# EAGLE design h-bridge (EAGLE 7.6.0)
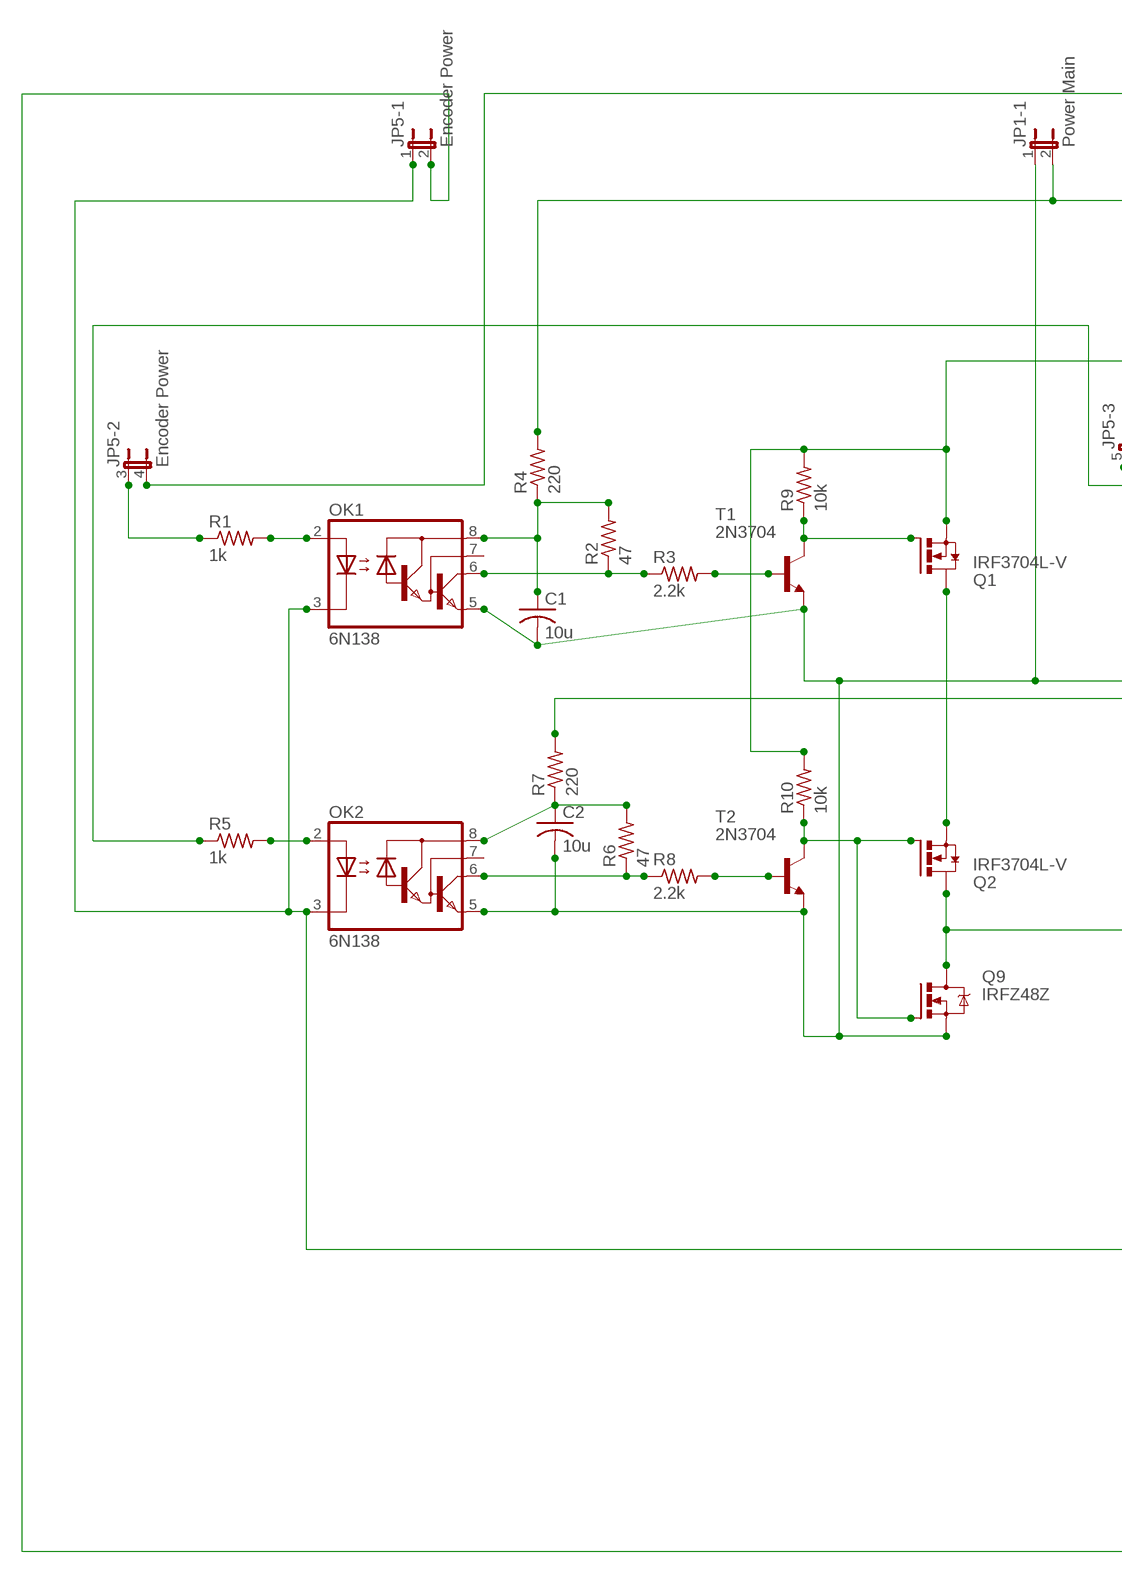
[diagram p0: schematic, sheet 1, part 1 of 2]
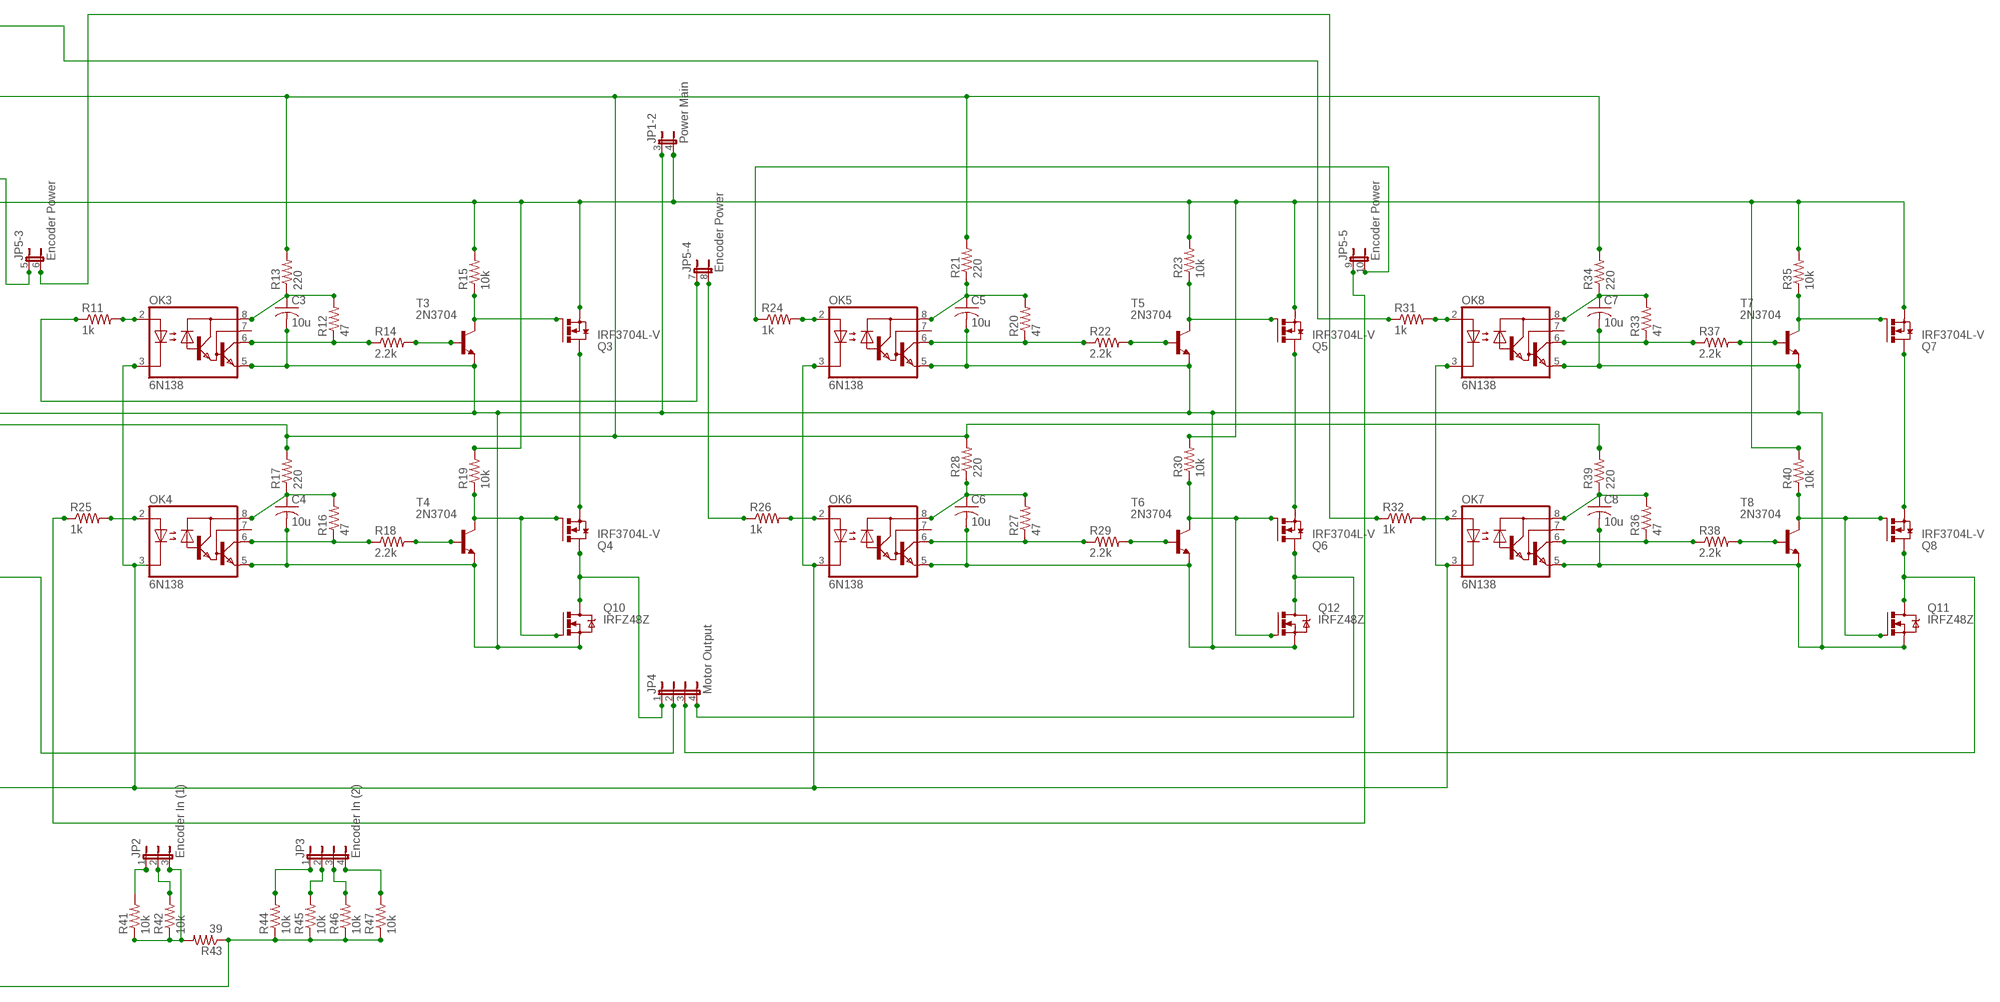
[diagram p1: schematic, sheet 1, part 2 of 2]

## Parts
C1  10u  C-US025-025X050  [C025-025X050]
C2  10u  C-US025-025X050  [C025-025X050]
C3  10u  C-US025-025X050  [C025-025X050]
C4  10u  C-US025-025X050  [C025-025X050]
C5  10u  C-US025-025X050  [C025-025X050]
C6  10u  C-US025-025X050  [C025-025X050]
C7  10u  C-US025-025X050  [C025-025X050]
C8  10u  C-US025-025X050  [C025-025X050]
JP1  Power Main  JP2QE  [JP2Q]
JP2  Encoder In (1)  JP2E  [JP2]
JP3  Encoder In (2)  JP4E  [JP4]
JP4  Motor Output  JP4E  [JP4]
JP5  Encoder Power  JP5QE  [JP5Q]
OK1  6N138  [DIL08]
OK2  6N138  [DIL08]
OK3  6N138  [DIL08]
OK4  6N138  [DIL08]
OK5  6N138  [DIL08]
OK6  6N138  [DIL08]
OK7  6N138  [DIL08]
OK8  6N138  [DIL08]
Q1  IRF3704L-V  [TO262-V]
Q2  IRF3704L-V  [TO262-V]
Q3  IRF3704L-V  [TO262-V]
Q4  IRF3704L-V  [TO262-V]
Q5  IRF3704L-V  [TO262-V]
Q6  IRF3704L-V  [TO262-V]
Q7  IRF3704L-V  [TO262-V]
Q8  IRF3704L-V  [TO262-V]
Q9  IRFZ48Z  [TO220BH]
Q10  IRFZ48Z  [TO220BH]
Q11  IRFZ48Z  [TO220BH]
Q12  IRFZ48Z  [TO220BH]
R1  1k  R-US_0207/10  [0207/10]
R2  47  R-US_0207/10  [0207/10]
R3  2.2k  R-US_0207/10  [0207/10]
R4  220  R-US_0207/10  [0207/10]
R5  1k  R-US_0207/10  [0207/10]
R6  47  R-US_0207/10  [0207/10]
R7  220  R-US_0207/10  [0207/10]
R8  2.2k  R-US_0207/10  [0207/10]
R9  10k  R-US_0207/10  [0207/10]
R10  10k  R-US_0207/10  [0207/10]
R11  1k  R-US_0207/10  [0207/10]
R12  47  R-US_0207/10  [0207/10]
R13  220  R-US_0207/10  [0207/10]
R14  2.2k  R-US_0207/10  [0207/10]
R15  10k  R-US_0207/10  [0207/10]
R16  47  R-US_0207/10  [0207/10]
R17  220  R-US_0207/10  [0207/10]
R18  2.2k  R-US_0207/10  [0207/10]
R19  10k  R-US_0207/10  [0207/10]
R20  47  R-US_0207/10  [0207/10]
R21  220  R-US_0207/10  [0207/10]
R22  2.2k  R-US_0207/10  [0207/10]
R23  10k  R-US_0207/10  [0207/10]
R24  1k  R-US_0207/10  [0207/10]
R25  1k  R-US_0207/10  [0207/10]
R26  1k  R-US_0207/10  [0207/10]
R27  47  R-US_0207/10  [0207/10]
R28  220  R-US_0207/10  [0207/10]
R29  2.2k  R-US_0207/10  [0207/10]
R30  10k  R-US_0207/10  [0207/10]
R31  1k  R-US_0207/10  [0207/10]
R32  1k  R-US_0207/10  [0207/10]
R33  47  R-US_0207/10  [0207/10]
R34  220  R-US_0207/10  [0207/10]
R35  10k  R-US_0207/10  [0207/10]
R36  47  R-US_0207/10  [0207/10]
R37  2.2k  R-US_0207/10  [0207/10]
R38  2.2k  R-US_0207/10  [0207/10]
R39  220  R-US_0207/10  [0207/10]
R40  10k  R-US_0207/10  [0207/10]
R41  10k  R-US_0207/10  [0207/10]
R42  10k  R-US_0207/10  [0207/10]
R43  39  R-US_0207/10  [0207/10]
R44  10k  R-US_0207/10  [0207/10]
R45  10k  R-US_0207/10  [0207/10]
R46  10k  R-US_0207/10  [0207/10]
R47  10k  R-US_0207/10  [0207/10]
T1  2N3704  [TO92]
T2  2N3704  [TO92]
T3  2N3704  [TO92]
T4  2N3704  [TO92]
T5  2N3704  [TO92]
T6  2N3704  [TO92]
T7  2N3704  [TO92]
T8  2N3704  [TO92]

## Nets
GND: C1.2 C2.2 C3.2 C4.2 C5.2 C6.2 C7.2 C8.2 JP1.1 JP1.3 OK1.5(GND) OK2.5(GND) OK3.5(GND) OK4.5(GND) OK5.5(GND) OK6.5(GND) OK7.5(GND) OK8.5(GND) Q9.S Q10.S Q11.S Q12.S T1.3(E) T2.3(E) T3.3(E) T4.3(E) T5.3(E) T6.3(E) T7.3(E) T8.3(E)
N$1: C1.1 OK1.8(VCC) R2.2 R4.1
N$2: JP5.1 OK1.3(C) OK2.3(C) OK3.3(C) OK4.3(C) OK5.3(C) OK6.3(C) OK7.3(C) OK8.3(C)
N$3: Q2.1(G) Q9.G R10.1 T2.2(C)
N$4: JP1.2 R4.2 R7.2 R13.2 R17.2 R21.2 R28.2 R34.2 R39.2
N$5: C3.1 OK3.8(VCC) R12.2 R13.1
N$6: OK3.6(VO) R12.1 R14.1
N$7: OK5.2(A) R24.2
N$8: OK6.2(A) R26.2
N$9: OK4.2(A) R25.2
N$10: OK3.2(A) R11.2
N$11: OK1.6(VO) R2.1 R3.1
N$12: R3.2 T1.1(B)
N$13: Q1.1(G) R9.1 T1.2(C)
N$14: OK1.2(A) R1.2
N$15: OK2.2(A) R5.2
N$16: JP5.8 R26.1
N$17: C2.1 OK2.8(VCC) R6.2 R7.1
N$18: OK2.6(VO) R6.1 R8.1
N$19: R8.2 T2.1(B)
N$20: Q1.2(D) Q2.3(S)
N$21: JP4.2 Q2.2(D) Q9.D
N$22: R14.2 T3.1(B)
N$23: Q3.1(G) R15.1 T3.2(C)
N$24: C4.1 OK4.8(VCC) R16.2 R17.1
N$25: JP2.1 R41.2
N$26: OK4.6(VO) R16.1 R18.1
N$27: R18.2 T4.1(B)
N$28: Q4.1(G) Q10.G R19.1 T4.2(C)
N$29: Q3.2(D) Q4.3(S)
N$30: JP4.1 Q4.2(D) Q10.D
N$31: C5.1 OK5.8(VCC) R20.2 R21.1
N$32: C6.1 OK6.8(VCC) R27.2 R28.1
N$33: JP2.2 R42.2
N$34: JP2.3 R41.1 R42.1 R43.2
N$35: OK6.6(VO) R27.1 R29.1
N$36: OK5.6(VO) R20.1 R22.1
N$37: Q5.1(G) R23.1 T5.2(C)
N$38: R22.2 T5.1(B)
N$39: R29.2 T6.1(B)
N$40: Q6.1(G) Q12.G R30.1 T6.2(C)
N$41: Q7.2(D) Q8.3(S)
N$42: JP4.4 Q6.2(D) Q12.D
N$43: Q5.2(D) Q6.3(S)
N$44: C7.1 OK8.8(VCC) R33.2 R34.1
N$45: JP5.2 R43.1 R44.1 R45.1 R46.1 R47.1
N$46: OK8.6(VO) R33.1 R37.1
N$47: C8.1 OK7.8(VCC) R36.2 R39.1
N$48: JP3.2 R45.2
N$49: OK7.6(VO) R36.1 R38.1
N$50: R37.2 T7.1(B)
N$51: R38.2 T8.1(B)
N$52: Q7.1(G) R35.1 T7.2(C)
N$53: Q8.1(G) Q11.G R40.1 T8.2(C)
N$54: JP3.3 R46.2
N$55: JP4.3 Q8.2(D) Q11.D
N$56: OK8.2(A) R31.2
N$57: OK7.2(A) R32.2
N$58: JP5.5 R5.1
N$59: JP5.3 R1.1
N$60: JP5.9 R25.1
N$61: JP5.7 R11.1
N$62: JP5.10 R24.1
N$64: JP5.6 R32.1
N$65: JP5.4 R31.1
N$66: JP1.4 Q1.3(S) Q3.3(S) Q5.3(S) Q7.3(S) R9.2 R10.2 R15.2 R19.2 R23.2 R30.2 R35.2 R40.2
N$67: JP3.1 R44.2
N$68: JP3.4 R47.2
Unconnected: OK1.7(VB) OK2.7(VB) OK3.7(VB) OK4.7(VB) OK5.7(VB) OK6.7(VB) OK7.7(VB) OK8.7(VB)

## Library data of the parts
C1-C8 = resistor:C-US: CAPACITOR, American symbol
JP1 = jumper:JP2QE: JUMPER
JP2 = jumper:JP2E: JUMPER
JP3 JP4 = jumper:JP4E: JUMPER
JP5 = jumper:JP5QE: JUMPER
OK1-OK8 = optocoupler:6N138: MOTOROLA OPTO COUPLER; MF: VISHAY/TELEFUNKEN; MPN: 6N138; OC_FARNELL: 9860150; OC_NEWARK: 35K5294
Q1-Q8 = transistor-power:IRF3704: SMPS MOSFET HEXFET® Power MOSFET Source: http://www.irf.com/product-info/datasheets/data/irf3704.pdf
Q9-Q12 = transistor-power:IRFZ48: N Channel HEXFET® Power MOSFET Logic Level Source: http://www.irf.com/product-info/datasheets/data/irfz48z.pdf
R1-R47 = resistor:R-US_: RESISTOR, American symbol
T1-T8 = transistor-neu-to92:2N3704: NPN TRANSISTOR

## Board
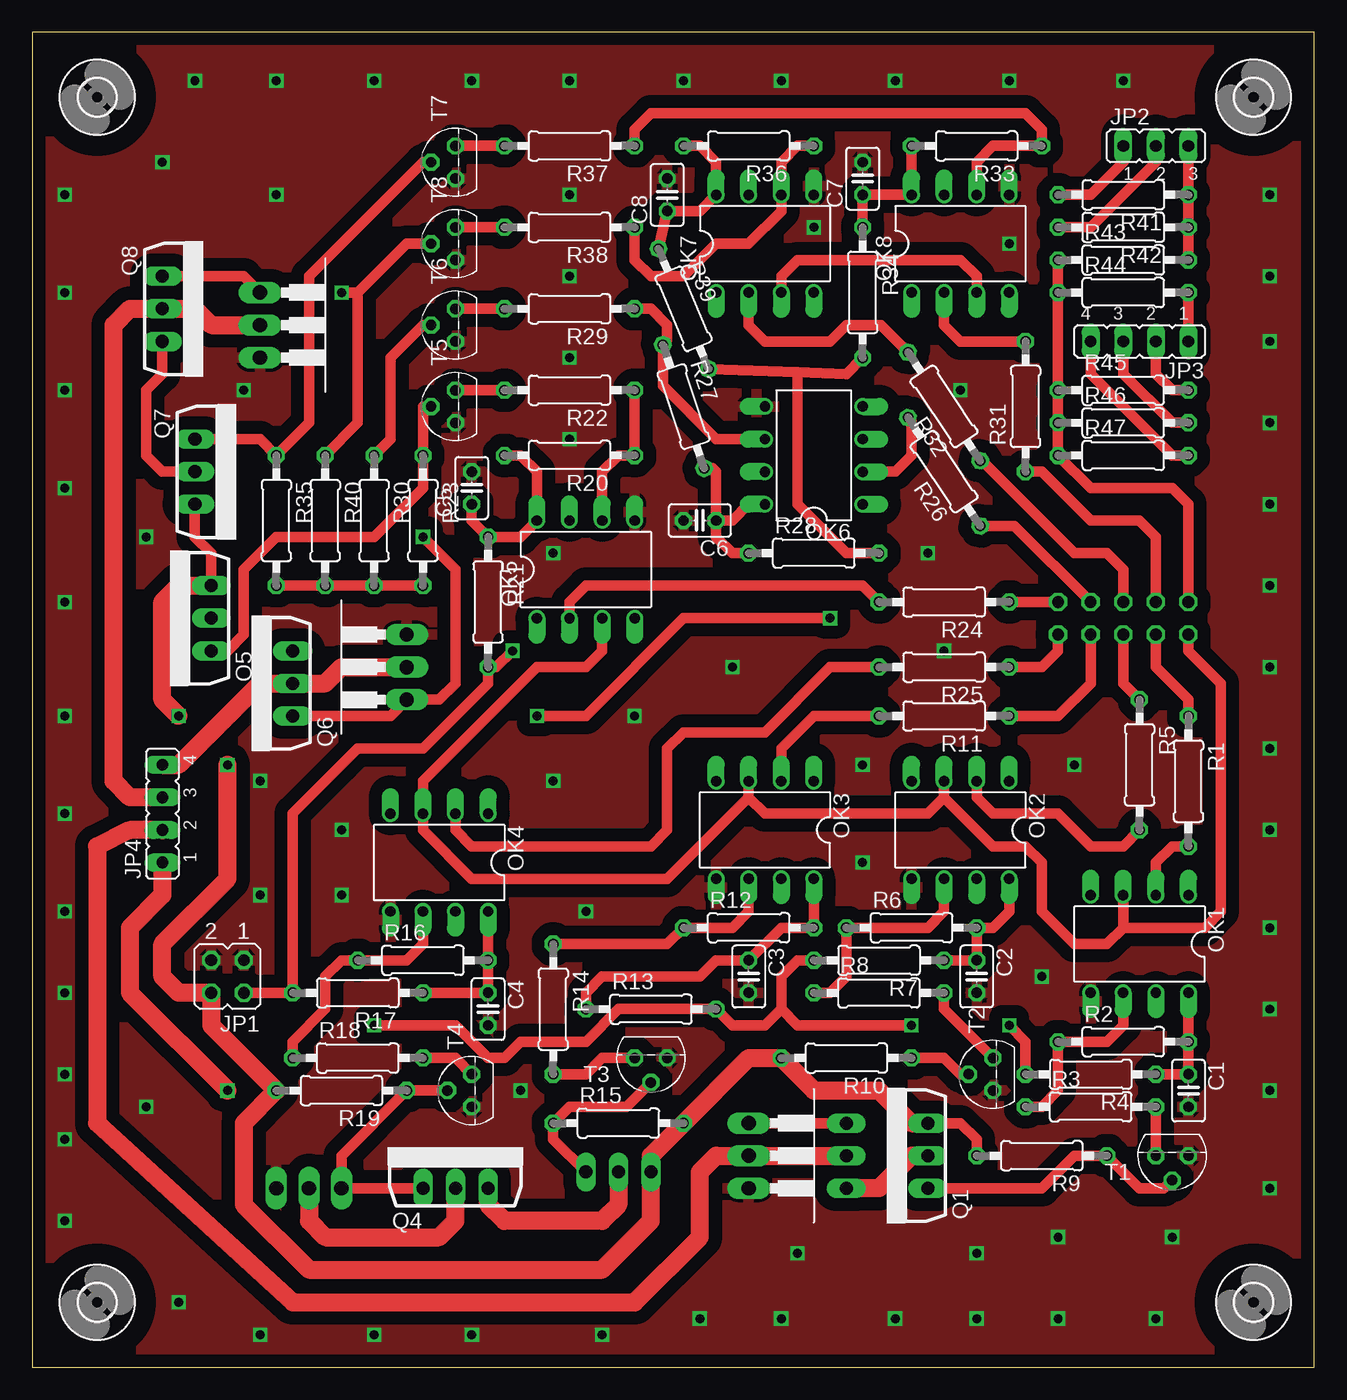
[diagram p2: board, top side]
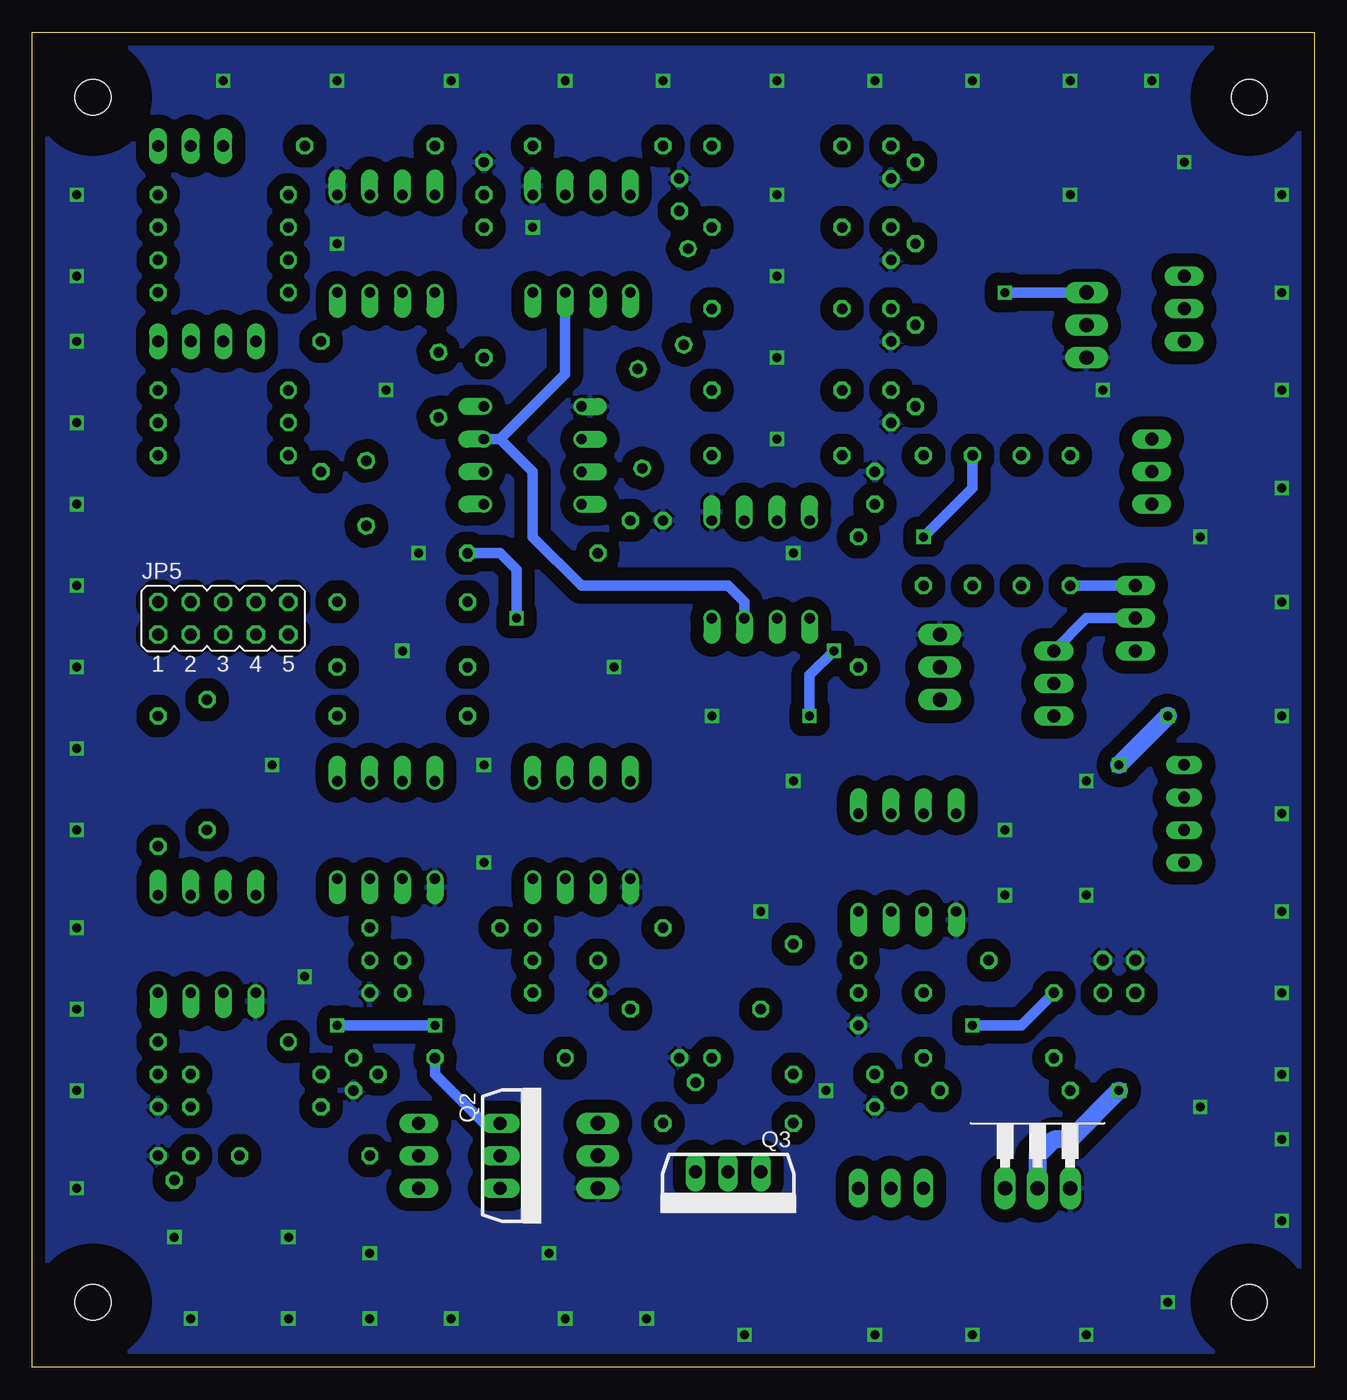
[diagram p3: board, bottom side, seen from below]

Size 100 x 104.13 mm. Coordinates in mm from the lower left corner, seen from the top.
Outline: 0,0 100,0 100,104.13 0,104.13 0,0
Copper layers (1*16): Top 0.035mm / dielectric 1.5mm / Bottom 0.035mm
Design rules "default *": minimum track width 10mil, minimum drill 24mil, track to track 10mil, track to pad 10mil, pad to pad 10mil, via to via 10mil, smd to smd 8mil, copper to edge 40mil, drill to drill 8mil, minimum pad ring 10mil, minimum via ring 8mil, stop-mask expansion 4mil, vias tented up to drill 0mil, thermal gap 10mil

### Footprints (pad centres in the part's own frame; a part is rotated, then mirrored left to right if it is on the bottom)
C025-025X050 = drill 0.813 octagon: 1 -1.27,0; 2 1.27,0
JP2Q = drill 0.914 octagon: 1 -1.27,-1.27; 2 -1.27,1.27; 3 1.27,-1.27; 4 1.27,1.27
JP2 = drill 0.914 long: 1 -2.54,0; 2 0,0; 3 2.54,0
JP4 = drill 0.914 long: 1 -3.81,0; 2 -1.27,0; 3 1.27,0; 4 3.81,0
JP5Q = drill 0.914 octagon: 1 -5.08,-1.27; 2 -5.08,1.27; 3 -2.54,-1.27; 4 -2.54,1.27; 5 0,-1.27; 6 0,1.27; 7 2.54,-1.27; 8 2.54,1.27; 9 5.08,-1.27; 10 5.08,1.27
DIL08 = drill 0.813 offset: 1 -3.81,-3.81; 2 -1.27,-3.81; 3 1.27,-3.81; 4 3.81,-3.81; 5 3.81,3.81; 6 1.27,3.81; 7 -1.27,3.81; 8 -3.81,3.81
TO262-V = drill 1.016 long: 1 -2.54,0; 2 0,0; 3 2.54,0
TO220BH = drill 1.118 long: D 0,-6.35; G -2.54,-6.35; S 2.54,-6.35
0207/10 = drill 0.813 octagon: 1 -5.08,0; 2 5.08,0
TO92 = drill 0.813 octagon: 1 1.27,0; 2 0,1.905; 3 -1.27,0
2,8 = hole 2.8: 0,0

### Placement (x,y rotation side)
C1  90.17,21.59 270 top
C2  73.66,30.48 270 top
C3  55.88,30.48 270 top
C4  35.56,27.94 270 top
C5  34.29,68.58 90 top
C6  52.07,66.04 180 top
C7  64.77,92.71 90 top
C8  49.53,91.44 90 top
JP1  15.24,30.48 180 top
JP2  87.63,95.25 0 top
JP3  86.36,80.01 180 top
JP4  10.16,43.18 90 top
JP5  85.09,58.42 0 bottom
OK1  86.36,33.02 180 top
OK2  72.39,41.91 180 top
OK3  57.15,41.91 180 top
OK4  31.75,39.37 180 top
OK5  43.18,62.23 0 top
OK6  60.96,71.12 90 top
OK7  57.15,87.63 0 top
OK8  72.39,87.63 0 top
Q1  69.85,16.51 90 top
Q2  63.5,16.51 270 bottom
Q3  45.72,15.24 180 bottom
Q4  33.02,13.97 0 top
Q5  13.97,58.42 90 top
Q6  20.32,53.34 90 top
Q7  12.7,69.85 270 top
Q8  10.16,82.55 270 top
Q9  62.23,16.51 270 top
Q10  21.59,20.32 0 bottom
Q11  24.13,81.28 270 top
Q12  22.86,54.61 90 top
R1  90.17,45.72 270 top
R2  85.09,25.4 0 top
R3  82.55,20.32 0 top
R4  82.55,22.86 180 top
R5  86.36,46.99 270 top
R6  68.58,34.29 0 top
R7  66.04,31.75 180 top
R8  66.04,29.21 0 top
R9  78.74,16.51 180 top
R10  63.5,24.13 180 top
R11  71.12,50.8 180 top
R12  55.88,34.29 0 top
R13  48.26,27.94 0 top
R14  40.64,27.94 270 top
R15  45.72,19.05 0 top
R16  30.48,31.75 0 top
R17  25.4,29.21 180 top
R18  25.4,24.13 0 top
R19  24.13,21.59 180 top
R20  41.91,71.12 180 top
R21  35.56,59.69 270 top
R22  41.91,76.2 180 top
R23  30.48,66.04 270 top
R24  71.12,59.69 180 top
R25  71.12,54.61 180 top
R26  71.12,69.85 123.7 top
R27  50.8,74.93 288.5 top
R28  60.96,63.5 0 top
R29  41.91,82.55 180 top
R30  26.67,66.04 270 top
R31  77.47,74.93 90 top
R32  71.12,74.93 123.7 top
R33  73.66,95.25 180 top
R34  64.77,83.82 270 top
R35  19.05,66.04 270 top
R36  55.88,95.25 180 top
R37  41.91,95.25 180 top
R38  41.91,88.9 180 top
R39  50.8,82.55 292.6 top
R40  22.86,66.04 270 top
R41  85.09,91.44 180 top
R42  85.09,88.9 180 top
R43  85.09,86.36 0 top
R44  85.09,83.82 0 top
R45  85.09,76.2 0 top
R46  85.09,73.66 0 top
R47  85.09,71.12 0 top
T1  88.9,16.51 180 top
T2  74.93,22.86 90 top
T3  48.26,24.13 180 top
T4  34.29,21.59 90 top
T5  33.02,74.93 90 top
T6  33.02,81.28 90 top
T7  33.02,93.98 90 top
T8  33.02,87.63 90 top
U$1  [2,8]  5.08,99.06 0 top
U$2  [2,8]  5.08,5.08 0 top
U$3  [2,8]  95.25,5.08 0 top
U$4  [2,8]  95.25,99.06 0 top

### Tracks (layer width: path | path; a pad name or v marks a point on that pad's centre or on a via)
GND  (via drill 0.7)
  other vias: 12.7,100.33 19.05,100.33 26.67,100.33 34.29,100.33 41.91,100.33 50.8,100.33 58.42,100.33 67.31,100.33 76.2,100.33 85.09,100.33 96.52,91.44 96.52,85.09 96.52,80.01 96.52,73.66 96.52,67.31 96.52,60.96 96.52,54.61 96.52,48.26 96.52,41.91 96.52,34.29 96.52,27.94 96.52,21.59 96.52,13.97 87.63,3.81 80.01,3.81 73.66,3.81 67.31,3.81 58.42,3.81 52.07,3.81 44.45,2.54 34.29,2.54 26.67,2.54 17.78,2.54 11.43,5.08 2.54,11.43 2.54,17.78 2.54,22.86 2.54,29.21 2.54,35.56 2.54,43.18 2.54,50.8 2.54,59.69 2.54,68.58 2.54,76.2 2.54,83.82 2.54,91.44 10.16,93.98 19.05,91.44 40.64,45.72 54.61,54.61 46.99,50.8 24.13,41.91 24.13,36.83 43.18,35.56 64.77,39.37 64.77,46.99 81.28,46.99 69.85,63.5 72.39,76.2 41.91,91.44 41.91,85.09 41.91,78.74 41.91,72.39 17.78,36.83 8.89,20.32 78.74,30.48 71.12,55.88 16.51,76.2 8.89,64.77 76.2,87.63 80.01,10.16 73.66,8.89 59.69,8.89 88.9,10.16 40.64,63.5 38.1,21.59 60.96,88.9 17.78,45.72
  pour Bottom (isolate 1.016): 0,104.14 100.33,104.14 100.33,0 0,0
  pour Top (isolate 1.016): 0,104.14 100.33,104.14 100.33,0 0,0
N$1
  Top 0.813: OK1.8 R2.2 C1.1 R4.1
N$2
  Top 0.813: OK3.3 55.88,44.45 | 55.88,44.45 57.15,43.18 69.85,43.18 71.12,44.45 | OK2.3 71.12,44.45 | 71.12,44.45 74.93,40.64 77.47,40.64 78.74,39.37 78.74,35.56 81.28,33.02 83.82,33.02 85.09,34.29 | 85.09,34.29 OK1.3 | 55.88,44.45 49.53,38.1 34.29,38.1 30.48,41.91 OK4.3 30.48,45.72 39.37,54.61 43.18,54.61 44.45,55.88 OK5.3 | JP5.1 90.17,55.88 92.71,53.34 92.71,35.56 91.44,34.29 85.09,34.29 | OK7.3 58.42,85.09 59.69,86.36 72.39,86.36 73.66,85.09 OK8.3
  Bottom 0.813: OK7.3 58.42,77.47 63.5,72.39 | 66.04,72.39 OK6.3 63.5,72.39 | OK5.3 44.45,59.69 45.72,60.96 57.15,60.96 60.96,64.77 60.96,69.85 63.5,72.39
N$3
  Top 0.813: T2.2 72.39,22.86 71.12,24.13 R10.1 | Q9.G Q2.1
  Bottom 0.813: Q2.1 64.77,19.05 68.58,22.86 R10.1
N$4  (via drill 0.7)
  Top 0.813: R7.2 59.69,31.75 58.42,30.48 58.42,27.94 | 58.42,27.94 59.69,26.67 v68.58,26.67 | v76.2,26.67 77.47,25.4 R4.2 | 58.42,27.94 57.15,26.67 54.61,26.67 R13.2 45.72,27.94 43.18,25.4 38.1,25.4 36.83,24.13 35.56,24.13 33.02,26.67 v26.67,26.67 | R39.2 59.7,77.61 | 59.7,77.61 63.5,77.47 R34.2 | R28.2 63.5,63.5 59.69,67.31 59.69,77.6 59.7,77.61 | v62.23,58.42 50.8,58.42 43.18,50.8 v39.37,50.8 | JP1.2 R17.2 20.32,43.18 25.4,48.26 30.48,48.26 35.56,53.34 R21.2 36.2,54.61 v37.47,55.88
  Bottom 0.813: v68.58,26.67 v76.2,26.67 | v26.67,26.67 22.86,26.67 R17.2 | v62.23,58.42 62.23,62.23 63.5,63.5 R28.2 | v39.37,50.8 39.37,53.98 v37.47,55.88
N$5
  Top 0.813: R13.1 43.18,29.21 44.45,30.48 52.07,30.48 53.34,31.75 C3.1 58.42,34.29 R12.2 OK3.8
N$6
  Top 0.813: R14.1 49.53,33.02 R12.1 54.61,34.29 55.88,35.56 OK3.6
N$7
  Top 0.813: OK5.2 41.91,59.69 43.18,60.96 64.77,60.96 R24.2
N$8
  Top 0.813: OK6.2 67.31,69.85 68.58,71.12 68.58,73.8 R26.2
N$9
  Top 0.813: OK4.2 33.02,41.91 34.29,40.64 48.26,40.64 49.53,41.91 49.53,48.26 50.8,49.53 57.15,49.53 62.23,54.61 R25.2
N$10
  Top 0.813: OK3.2 58.42,48.26 60.96,50.8 R11.2
N$11
  Top 0.813: OK1.6 85.09,26.67 83.82,25.4 R2.1 80.01,21.59 78.74,20.32 R3.1
N$12
  Top 0.813: R3.2 T1.1
N$13
  Top 0.813: T1.2 88.26,13.97 86.36,13.97 R9.1 81.28,16.51 78.74,13.97 Q1.1
N$14
  Top 0.813: OK1.2 87.63,39.37 88.9,40.64 R1.2
N$15
  Top 0.813: OK2.2 73.66,44.45 74.93,43.18 80.01,43.18 82.55,40.64 85.09,40.64 R5.2
N$16
  Top 0.813: R26.1 76.62,65.62 JP5.8
N$17
  Top 0.813: OK2.8 76.2,35.56 74.93,34.29 R6.2 C2.1 R7.1
N$18
  Top 0.813: R8.1 62.23,29.21 63.5,30.48 R6.1 69.85,34.29 71.12,35.56 OK2.6
N$19
  Top 0.813: R8.2 71.12,27.94 T2.1
N$20
  Top 1.422: Q1.2 68.58,16.51 66.04,13.97 Q2.3
N$21
  Top 1.422: Q2.2 Q9.D 53.34,16.51 52.07,15.24 52.07,10.16 46.99,5.08 20.32,5.08 5.08,19.05 5.08,40.64 7.62,41.91 JP4.2
N$22
  Top 0.813: R14.2 43.18,22.86 44.45,24.13 T3.1
N$23
  Top 0.813: Q3.1 40.64,17.78 R15.1 41.91,20.32 46.35,20.32 T3.2
N$24
  Top 0.813: OK4.8 R16.2 C4.1 R17.1
N$25
  Top 0.813: JP2.1 85.09,93.98 82.55,91.44 R41.2
N$26
  Top 0.813: OK4.6 30.48,33.02 29.21,31.75 R16.1 24.13,31.75 22.86,30.48 22.86,27.94 20.32,25.4 R18.1
N$27
  Top 0.813: R18.2 33.02,24.13 T4.1
N$28
  Top 0.813: T4.2 R19.1 24.13,16.51 Q10.G Q4.1
N$29
  Top 1.422: Q3.2 45.72,12.7 44.45,11.43 36.83,11.43 35.56,12.7 Q4.3
N$30  (via drill 0.7)
  Top 1.422: Q10.D 21.59,11.43 22.86,10.16 31.75,10.16 33.02,11.43 Q4.2 | JP4.1 10.16,36.83 7.62,34.29 7.62,29.21 v15.24,21.59
  Bottom 1.422: v15.24,21.59 19.05,17.78 20.32,17.78 21.59,16.51 Q10.D
N$31
  Top 0.813: R20.2 38.1,71.12 39.37,69.85 OK5.8 38.1,64.77 R21.1 34.29,66.04 C5.1
N$32
  Top 0.813: R27.2 53.08,70.11 53.34,69.85 C6.1 | C6.1 54.61,66.04 55.88,67.31 OK6.8 | R28.1 54.61,63.5 53.34,64.77 C6.1
N$33
  Top 0.813: JP2.2 87.63,93.98 82.55,88.9 R42.2
N$34
  Top 0.813: JP2.3 R41.1 R42.1 R43.2
N$35
  Top 0.813: R29.1 48.26,82.55 49.53,81.28 49.53,80.09 R27.1 49.19,76.54 53.34,72.39 OK6.6
N$36
  Top 0.813: R22.1 R20.1 45.72,71.12 44.45,69.85 OK5.6
N$37
  Top 0.813: T5.2 30.48,74.93 R23.1 30.48,68.58 26.67,64.77 19.05,64.77 16.51,62.23 16.51,57.15 15.24,55.88 Q5.1
N$38
  Top 0.813: R22.2 T5.1
N$39
  Top 0.813: R29.2 T6.1
N$40  (via drill 0.7)
  Top 0.813: T6.2 30.48,81.28 27.94,78.74 27.94,72.39 R30.1 | v30.48,64.77 33.02,62.23 33.02,53.34 31.75,52.07 Q12.G 27.94,50.8 Q6.1
  Bottom 0.813: R30.1 26.67,68.58 v30.48,64.77
N$41
  Top 0.813: Q8.3 10.16,77.47 8.89,76.2 8.89,71.12 10.16,69.85 Q7.2
N$42
  Top 1.422: Q12.D 24.13,54.61 22.86,53.34 Q6.2 17.78,53.34 11.43,46.99 JP4.4
N$43
  Bottom 0.813: Q5.2 17.78,58.42 Q6.3
N$44
  Top 0.813: R33.2 OK8.8 C7.1 R34.1
N$45
  Top 0.813: R43.1 R44.1 R45.1 R46.1 R47.1 82.55,68.58 88.9,68.58 90.17,67.31 JP5.2
N$46
  Top 0.813: OK8.6 73.66,93.98 74.93,95.25 R33.1 78.74,96.52 77.47,97.79 48.26,97.79 46.99,96.52 R37.1
N$47
  Top 0.813: R36.2 52.07,95.25 53.34,93.98 OK7.8 52.07,90.17 C8.1 R39.1
N$48
  Top 0.813: JP3.2 87.63,77.47 88.9,76.2 R45.2
N$49
  Top 0.813: R36.1 59.69,95.25 58.42,93.98 OK7.6 58.42,90.17 55.88,87.63 53.34,87.63 50.8,85.09 48.26,85.09 46.99,86.36 R38.1
N$50
  Top 0.813: R37.2 T7.1
N$51
  Top 0.813: R38.2 T8.1
N$52
  Top 0.813: T7.2 30.48,93.98 21.59,85.09 21.59,73.66 R35.1 17.78,72.39 Q7.1
N$53  (via drill 0.7)
  Top 0.813: Q8.1 16.51,85.09 Q11.G | T8.2 29.21,87.63 25.4,83.82 | 25.4,83.82 25.4,73.66 R40.1 | v24.13,83.82 25.4,83.82
  Bottom 0.813: Q11.G v24.13,83.82
N$54
  Top 0.813: JP3.3 85.09,77.47 88.9,73.66 R46.2
N$55
  Top 1.422: Q11.D 13.97,81.28 12.7,82.55 Q8.2 7.62,82.55 6.35,81.28 6.35,45.72 7.62,44.45 JP4.3
N$56
  Top 0.813: OK8.2 71.12,81.28 72.39,80.01 R31.2
N$57
  Top 0.813: OK7.2 55.88,81.28 57.15,80.01 62.23,80.01 63.5,81.28 66.18,81.28 R32.2
N$58
  Top 0.813: JP5.5 85.09,53.34 R5.1
N$59
  Top 0.813: JP5.3 87.63,54.61 90.17,52.07 R1.1
N$60
  Top 0.813: R25.1 78.74,54.61 80.01,55.88 JP5.9
N$61
  Top 0.813: R11.1 80.01,50.8 82.55,53.34 JP5.7
N$62
  Top 0.813: R24.1 JP5.10
N$64
  Top 0.813: R32.1 74.08,70.7 81.28,63.5 83.82,63.5 85.09,62.23 JP5.6
N$65
  Top 0.813: R31.1 78.74,69.85 82.55,66.04 86.36,66.04 87.63,64.77 JP5.4
N$66  (via drill 0.7)
  Top 0.813: Q1.3 72.39,19.05 73.66,17.78 R9.2 | R23.2 R30.2 R40.2 R35.2 | Q7.3 12.7,64.77 13.97,63.5 Q5.3
  Top 1.422: Q1.3 68.58,19.05 66.04,21.59 60.96,21.59 R10.2 55.88,24.13 R15.2 48.26,16.51 Q3.3 48.26,11.43 44.45,7.62 21.59,7.62 16.51,12.7 16.51,19.05 R19.2 13.97,26.67 JP1.4 11.43,29.21 10.16,30.48 10.16,33.02 15.24,38.1 v15.24,46.99 | v11.43,50.8 10.16,52.07 10.16,59.69 11.43,60.96 Q5.3
  Bottom 0.813: Q5.3 R35.2
  Bottom 1.422: v15.24,46.99 v11.43,50.8
N$67
  Top 0.813: R44.2 JP3.1
N$68
  Top 0.813: JP3.4 82.55,77.47 88.9,71.12 R47.2